# EAGLE design EasyEAP (EAGLE 8.6.0)
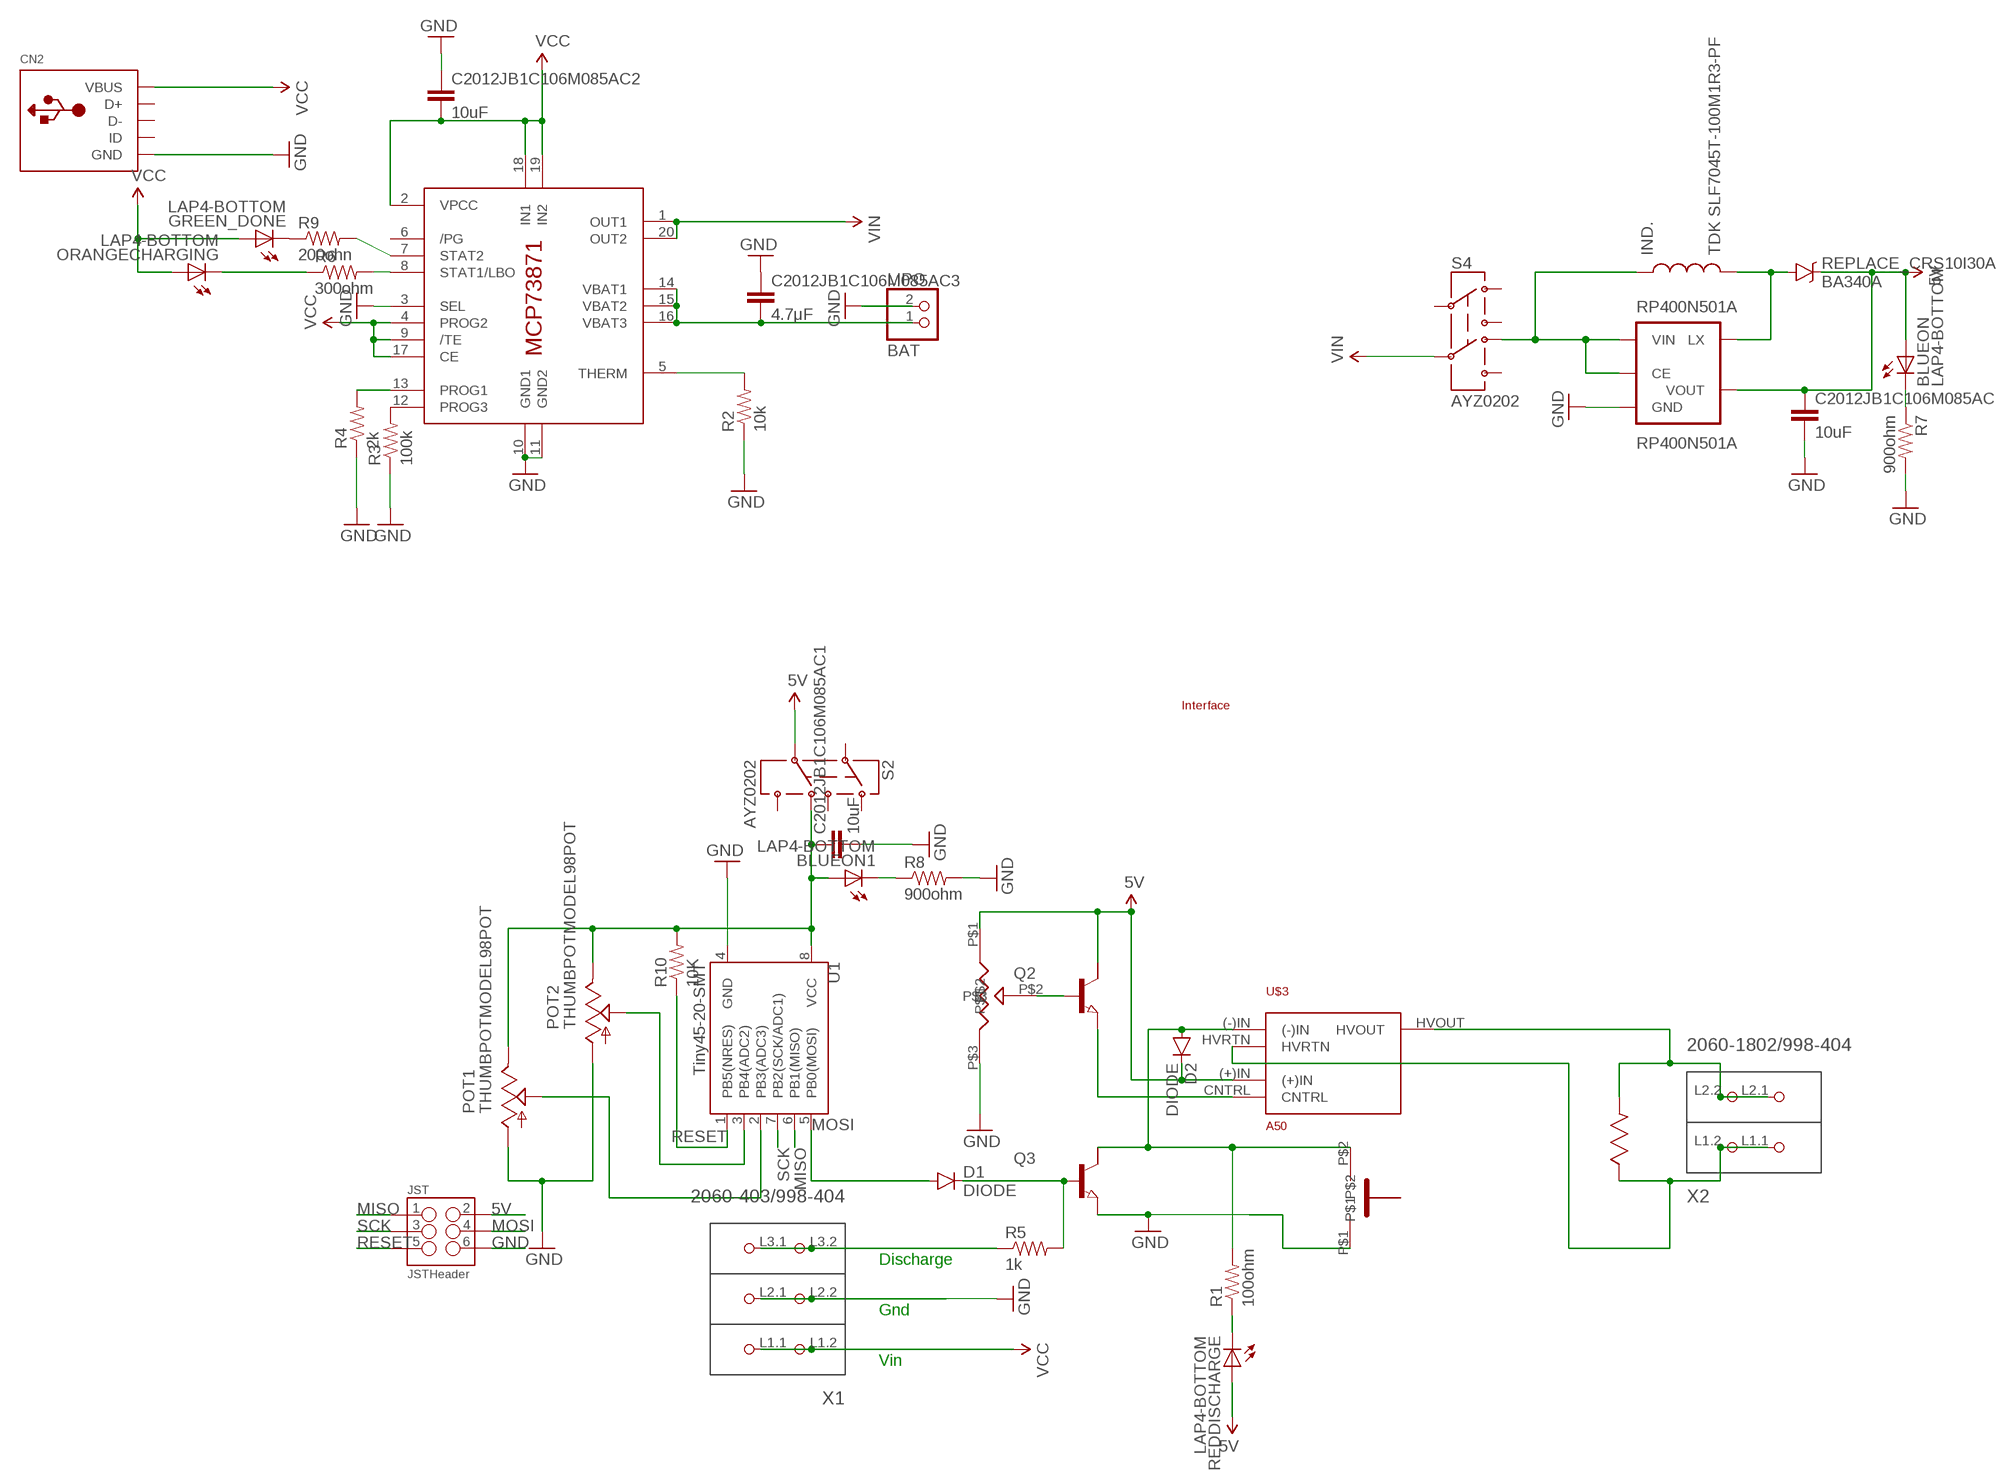
[diagram p0: schematic, sheet 1]

## Parts
BLUEON  LAP4-BOTTOM  [P47F-BOTTOM]
BLUEON1  LAP4-BOTTOM  [P47F-BOTTOM]
C2012JB1C106M085AC  10uF  22UF-16V-20%-(1210)  [1210]
C2012JB1C106M085AC1  10uF  22UF-16V-20%-(1210)  [1210]
C2012JB1C106M085AC2  10uF  22UF-16V-20%-(1210)  [1210]
C2012JB1C106M085AC3  4.7μF  22UF-16V-20%-(1210)  [1210]
CN2  USBMINIB  [USB-MINIB]
D1  DIODE  DIODESMA-ALT  [SMA-DIODE_ALT]
D2  DIODE  DIODESMA-ALT  [SMA-DIODE_ALT]
GREEN_DONE  LAP4-BOTTOM  [P47F-BOTTOM]
IC1  MCP73871  [QFN20]
IND.  TDK SLF7045T-100M1R3-PF  INDUCTOR-B82462G  [B82462G]
JST  JSTHeader  M03X2FEMALE_SMD  [2X3_SMD]
LIPO  BAT  JST_2PIN-SMT-RA  [JST-PH-2-SMT-RA]
ORANGECHARGING  LAP4-BOTTOM  [P47F-BOTTOM]
POT1  THUMBPOTMODEL98POT  [THUMBWHEEL]
POT2  THUMBPOTMODEL98POT  [THUMBWHEEL]
Q2  NPN-TRANSISTIOR-2COLSOT89  [SOT89]
Q3  NPN-TRANSISTIOR-2COLSOT89  [SOT89]
R1  100ohm  RESISTOR1206  [1206]
R2  10k  RESISTOR1206  [1206]
R3  100k  RESISTOR1206  [1206]
R4  2k  RESISTOR1206  [1206]
R5  1k  RESISTOR1206  [1206]
R6  300ohm  RESISTOR1206  [1206]
R7  900ohm  RESISTOR1206  [1206]
R8  900ohm  RESISTOR1206  [1206]
R9  200ohn  RESISTOR1206  [1206]
R10  10K  RESISTOR1206  [1206]
REDDISCHARGE  LAP4-BOTTOM  [P47F-BOTTOM]
REPLACE_CRS10I30A  BA340A  B340A  [SMA-DIODE]
RP400N501A  RP400N501A  [SOT23-5]
S2  AYZ0202  [AYZ0202]
S4  AYZ0202  [AYZ0202]
U1  Tiny45-20-SMT  ATTINY45TINY45-20-SMT  [SO08-EIAJ]
U$2  4020SMD  [4020SMD]
U$3  A50  [A50]
U$8  VISHAY  [VISHAY]
U$9  GRAYHILLPUSHBUTTON  [GRAYHILLSERIES30]
U$10  INTERFACE_EAP  [INTERFACE_EAP]
X1  2060-403/998-404  [P-2060-403/998-404]
X2  2060-1802/998-404  [P-2060-1802/998-404]

## Nets
5V: BLUEON.A C2012JB1C106M085AC.1 D2.C JST.2 Q2.2(C) REDDISCHARGE.A REPLACE_CRS10I30A.C RP400N501A.4(VOUT) S2.5 U$3.(+)IN U$8.P$1
5VSEQUENCE: BLUEON1.A C2012JB1C106M085AC1.1 POT1.3(E) POT2.3(E) R10.2 S2.6 U1.8(VCC)
15K: POT1.2(S) U1.2(PB3(ADC3))
DISCHARGE: R5.1 X1.L3.1(P3.1) X1.L3.2(P3.2)
GND: C2012JB1C106M085AC1.2 C2012JB1C106M085AC2.1 C2012JB1C106M085AC3.1 C2012JB1C106M085AC.2 CN2.GND IC1.3(SEL) IC1.10(GND1) IC1.11(GND2) JST.6 LIPO.2 POT1.1(A) POT2.1(A) Q3.3(E) R2.1 R3.1 R4.1 R7.2 R8.2 RP400N501A.2(GND) U1.4(GND) U$8.P$3 U$9.P$1 X1.L2.1(P2.1) X1.L2.2(P2.2)
HVIN: U$2.P$1 U$3.HVRTN X2.L1.1(P1.1) X2.L1.2(P1.2)
HVOUT: U$2.P$2 U$3.HVOUT X2.L2.1(P2.1) X2.L2.2(P2.2)
MISO: JST.1 U1.6(PB1(MISO))
MOSI: D1.A JST.4 U1.5(PB0(MOSI))
N$1: IND..P$2 REPLACE_CRS10I30A.A RP400N501A.5(LX)
N$2: D1.C Q3.1(B) R5.2
N$3: BLUEON.C R7.1
N$6: D2.A Q3.2(C) R1.2 U$3.(-)IN U$9.P$2
N$7: R1.1 REDDISCHARGE.C
N$8: BLUEON1.C R8.1
N$9: C2012JB1C106M085AC3.2 IC1.14(VBAT1) IC1.15(VBAT2) IC1.16(VBAT3) LIPO.1
N$10: Q2.3(E) U$3.CNTRL
N$11: IC1.5(THERM) R2.2
N$12: IC1.12(PROG3) R3.2
N$13: Q2.1(B) U$8.P$2
N$14: IC1.13(PROG1) R4.2
N$15: POT2.2(S) U1.3(PB4(ADC2))
N$18: IC1.8(STAT1/LBO) R6.2
N$20: ORANGECHARGING.C R6.1
N$21: IND..P$1 RP400N501A.1(CE) RP400N501A.3(VIN) S4.6
N$31: GREEN_DONE.C R9.1
N$32: IC1.7(STAT2) R9.2
RESET: JST.5 R10.1 U1.1(PB5(NRES))
SCK: JST.3 U1.7(PB2(SCK/ADC1))
VCC: C2012JB1C106M085AC2.2 CN2.VBUS GREEN_DONE.A IC1.2(VPCC) IC1.4(PROG2) IC1.9(/TE) IC1.17(CE) IC1.18(IN1) IC1.19(IN2) ORANGECHARGING.A X1.L1.1(P1.1) X1.L1.2(P1.2)
VIN: IC1.1(OUT1) IC1.20(OUT2) S4.5
Unconnected: CN2.D+ CN2.D- CN2.ID IC1.6(/PG) Q2.2@1(C/) Q3.2@1(C/) S2.1 S2.2 S2.3 S2.4 S4.1 S4.2 S4.3 S4.4

## Notes on the sheet
- Discharge
- Gnd
- Vin

## Library data of the parts
BLUEON BLUEON1 GREEN_DONE ORANGECHARGING REDDISCHARGE = led:*P4: PointLED® Enhanced Thinfilm LED TOP & BOTTOM mount LS P47F, LR P47F, LA P47F, LY P47F, LT P4SG, LB P4SG, LW P4SG Source: http://catalog.osram-os.com .. LA_LR_LS_LY_P47F_Pb_free.pdf
C2012JB1C106M085AC C2012JB1C106M085AC1-C2012JB1C106M085AC3 = SparkFun-Capacitors:22UF-16V-20%-(1210): CAP-10381; PROD_ID: CAP-10381; VALUE: 22uF
CN2 = adafruit:USB: USB Connectors USBMINIB - Surface Mount Female Mini-B USB Connector 4UConnector: 06564 By microbuilder.eu Thru-hole RA Female Mini-B USB Connector 4UConnector: 18732 By ladyada.net
D1 D2 = SparkFun-DiscreteSemi:DIODE: Diode These are standard reverse protection diodes and small signal diodes. SMA package can handle up to about 1A. SOD-323 can handle about 200mA. What the SOD-323 package when ordering, there are some mfgs out there that are 5-pin packages.
IC1 = adafruit:MCP73871
IND. = SparkFun:INDUCTOR: Inductors Basic Inductor/Choke - 0603 and 1206. Footprints are not proven and vary greatly between part numbers.
JST = SparkFun-Connectors:M03X2: 2x3 .1" header. Shrouded, with keying- CONN-10681 SMT- CONN-11415 Pogo pins- HW-11044; PROD_ID: CONN-11290
LIPO = adafruit:JST_2PIN: JST 2-Pin Connectors of various flavors SMT-RA (S2B-PH-SM4) 4UConnector #17311 SMT (B2B-PH-SM4) THM-RA (S2B-PH) THM (B2B-PH)
POT1 POT2 = Model93POT:THUMBPOT: Thumbwheel pot with switch Available in horizontal (Alpha RV121SF) or vertical (Xicon 311-1701)
Q2 Q3 = semicon-smd-ipc:NPN-TRANSISTIOR-2COL: NPN TRANSISTOR 2 colletor pins
R1-R10 = SparkFun-Resistors:RESISTOR: Resistor Basic schematic elements and footprints for 0603, 1206, and PTH resistors.
REPLACE_CRS10I30A = SparkFun-DiscreteSemi:B340A: Schottky Diode 3A-40V; PROD_ID: DIO-09886
RP400N501A = RP400N501A:RP400N501A
S2 S4 = SparkFun-Electromechanical:AYZ0202: SPDT Slide Switch Simple SMD single-pull double-throw slide switch. Good for less than 350mA power switch, switching UARTs between devices, etc. Spark Fun Electronics SKU : COM-00597; PROD_ID: SWCH-08179
U1 = SparkFun-DigitalIC:ATTINY45: Atmel 8-pin 2/4/8kB flash uC; PROD_ID: IC-08922
U$2 = smd4020:4020SMD
U$3 = EMCO:A50
U$8 = vishayPot:VISHAY
U$9 = grayhillPushButton:GRAYHILLPUSHBUTTON
U$10 = IAD_GRAFIX:INTERFACE_EAP
X1 = con-wago_2060:2060-403/998-404: Serie 2060, SMD-Leiterplattenklemme mit Betätigungsdrückern im Gurt 3-polig / Series 2060, SMD terminal block with push-buttons in tape-and-reel packing 3-pole Polzahl / Pole No.: 3 Rastermaß / Pitch: 4 mm Bemessungsspannung / Rated Voltage: 160 V Nennstrom / Nominal Current: 9 A Leiterquerschnitt / Conductor Size: 0.2 - 0.75 mm2 Anschlusstechnik / Connection Technology: CAGE CLAMP® S Leitereinführung (zur Platine) / Conductor entry angle (to PCB): 0 ° Farbe / Color: lichtgrau / light gray Stand: 01.01.2014. Die jeweils aktuellen Daten zu diesem Artikel finden Sie in unserem Produktkatalog, den Sie unter www.wago.com einsehen können. As of: 01/01/2014. Please find the newest data for this article in our product catalogue, which can be viewed under www.wago.com.
X2 = con-wago_2060:2060-1802/998-404: Serie 2060, THR-Leiterplattenklemme mit Betätigungsdrückern im Gurt 2-polig / Series 2060, THR terminal block with push-buttons in tape-and-reel packing 2-pole Polzahl / Pole No.: 2 Rastermaß / Pitch: 8 mm Bemessungsspannung / Rated Voltage: 630 V Nennstrom / Nominal Current: 9 A Leiterquerschnitt / Conductor Size: 0.2 - 0.75 mm2 Anschlusstechnik / Connection Technology: CAGE CLAMP® S Leitereinführung (zur Platine) / Conductor entry angle (to PCB): 0 ° Farbe / Color: lichtgrau / light gray Stand: 01.01.2014. Die jeweils aktuellen Daten zu diesem Artikel finden Sie in unserem Produktkatalog, den Sie unter www.wago.com einsehen können. As of: 01/01/2014. Please find the newest data for this article in our product catalogue, which can be viewed under www.wago.com.

## Board
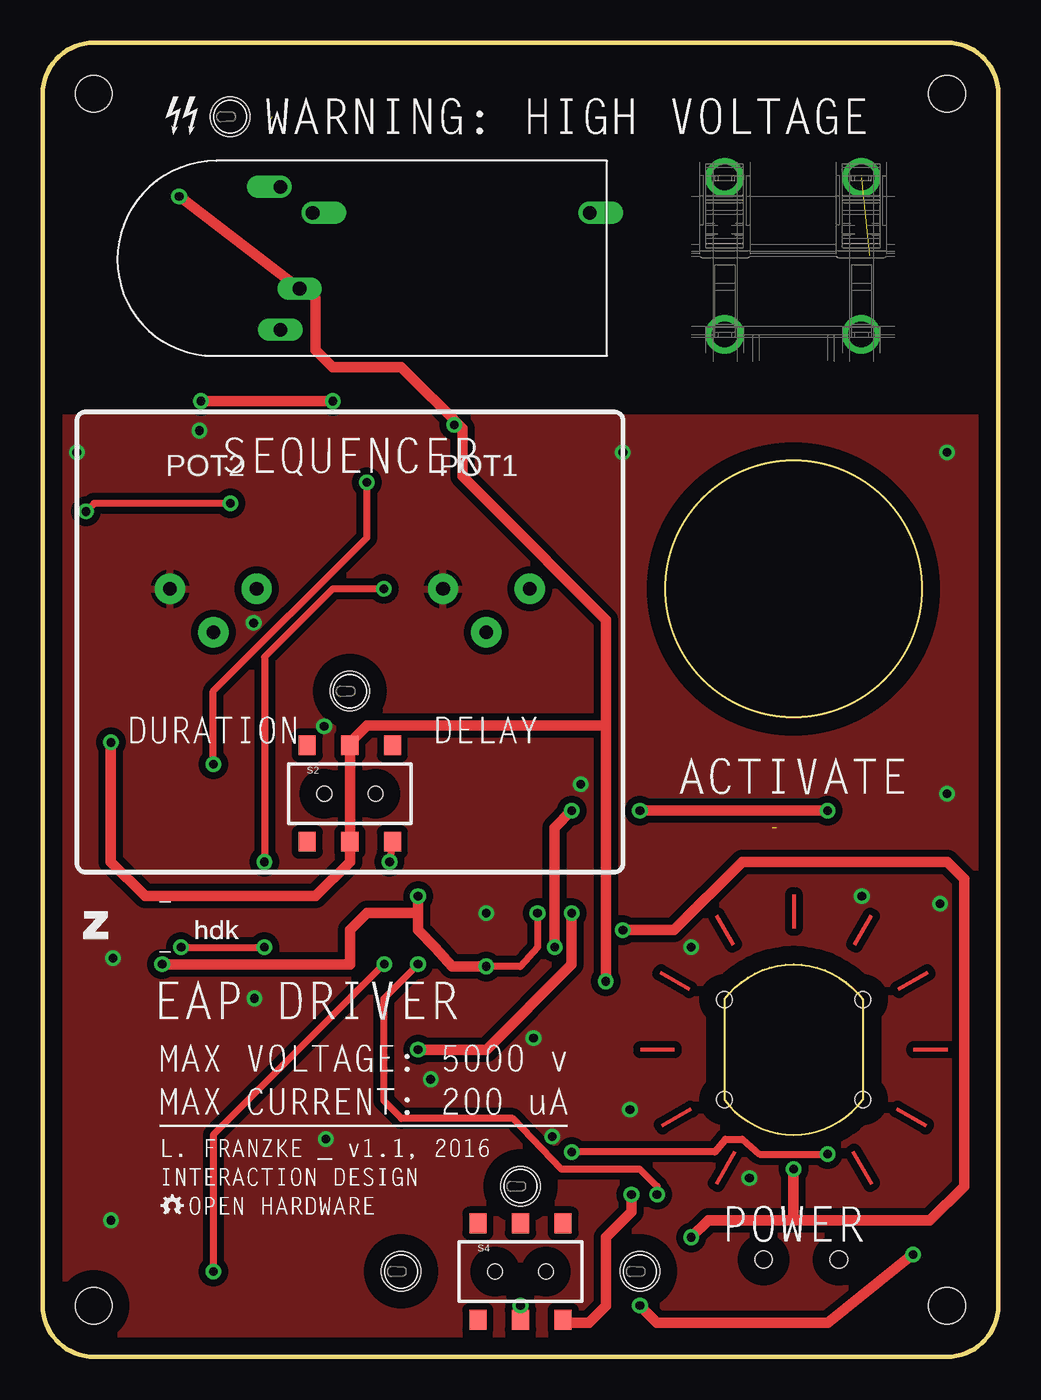
[diagram p1: board, top side]
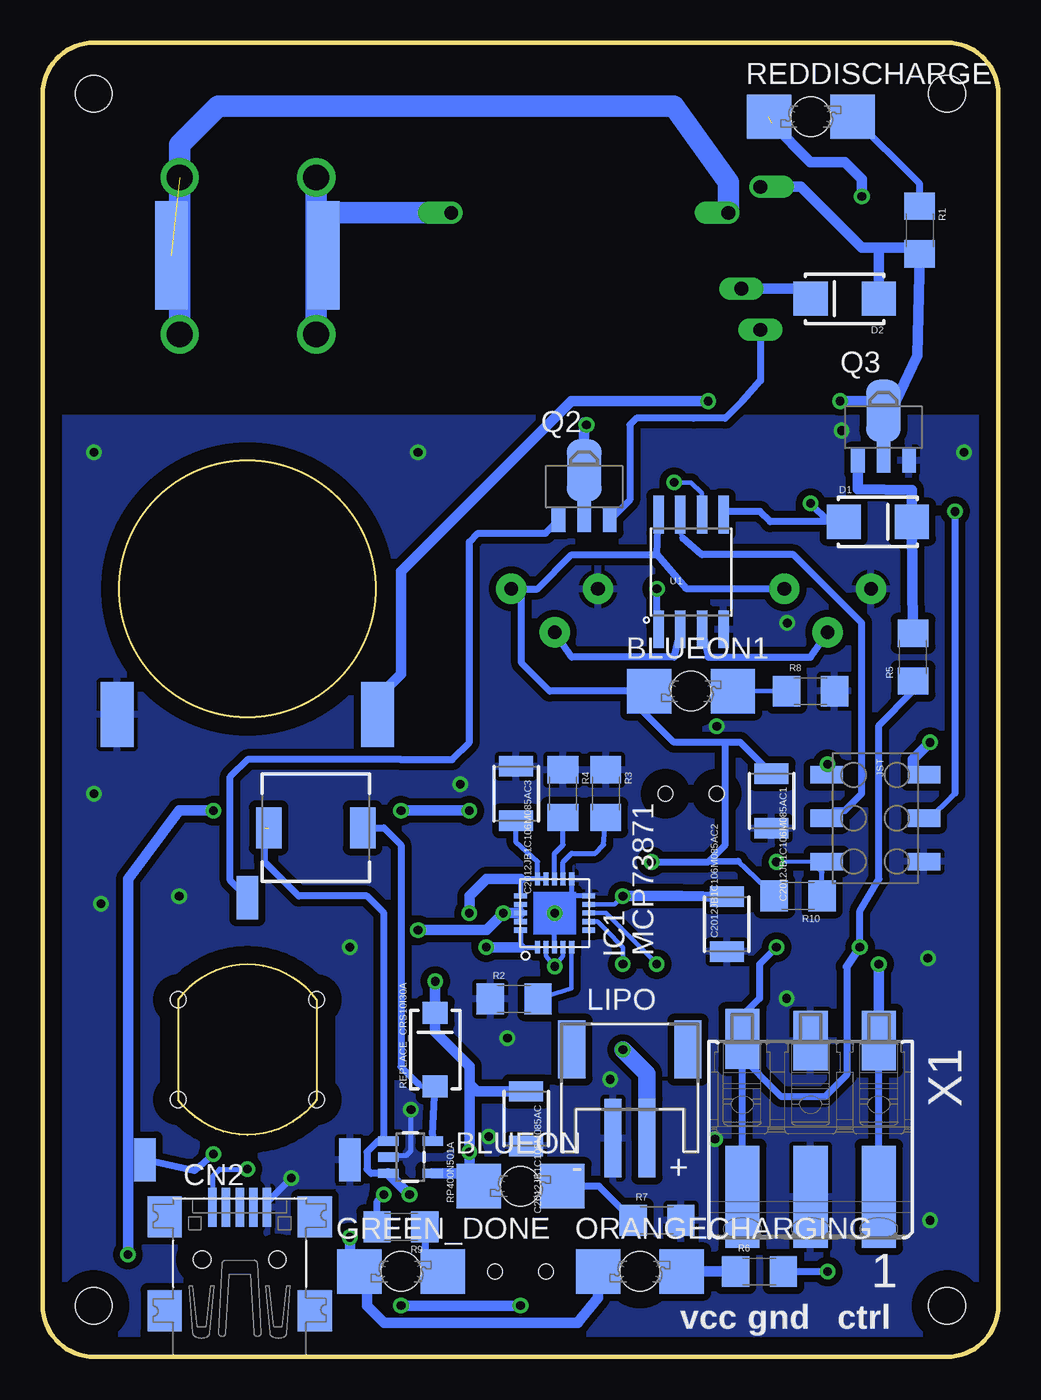
[diagram p2: board, bottom side, seen from below]

Size 56 x 77 mm. Coordinates in mm from the lower left corner, seen from the top.
Outline: 0,74 0,3 arc90 3,0 53,0 arc90 56,3 56,74 arc90 53,77 3,77 arc90 0,74
Copper layers (1*16): Top 0.035mm / dielectric 1.5mm / Bottom 0.035mm
Design rules "default *": minimum track width 15mil, minimum drill 12mil, track to track 8mil, track to pad 8mil, pad to pad 8mil, via to via 8mil, smd to smd 8mil, copper to edge 40mil, drill to drill 8mil, minimum pad ring 10mil, minimum via ring 8mil, stop-mask expansion 4mil, vias tented up to drill 0mil, thermal gap 10mil
Holes 2.13 mm at 3,3 3,74 53,74 3,3 53,3

### Footprints (pad centres in the part's own frame; a part is rotated, then mirrored left to right if it is on the bottom)
P47F-BOTTOM = smd 2.6 x 2.6: A -2.45,0; C 2.45,0 | hole 2.3: 0,0
1210 = smd 1.2 x 2: 1 -1.6,0; 2 1.6,0
USB-MINIB = smd 0.5 x 2.308: D+ 0,4.064; D- -0.8,4.064; GND 1.6,4.064; ID 0.8,4.064; VBUS -1.6,4.064 | smd 2 x 2.4: GND1 -4.4,-2; GND2 -4.4,3.5; GND3 4.4,3.5; GND4 4.4,-2 | hole 1: -2.2,1; 2.2,1
SMA-DIODE_ALT = smd 2 x 2: A -2,0; C 2,0
QFN20 = smd 0.75 x 0.3: 1 -2,1; 2 -2,0.5; 3 -2,0; 4 -2,-0.5; 5 -2,-1; 11 2,-1; 12 2,-0.5; 13 2,0; 14 2,0.5; 15 2,1 | smd 0.3 x 0.75: 6 -1,-2; 7 -0.5,-2; 8 0,-2; 9 0.5,-2; 10 1,-2; 16 1,2; 17 0.5,2; 18 0,2; 19 -0.5,2; 20 -1,2
B82462G = smd 2.4 x 1.5: P$1 0,2.75; P$2 0,-2.75
2X3_SMD = smd 1.02 x 1.9: 1 -2.54,-2.85; 2 -2.54,2.85; 3 0,-2.85; 4 0,2.85; 5 2.54,-2.85; 6 2.54,2.85
JST-PH-2-SMT-RA = smd 1 x 4.6: 1 1,-3.7; 2 -1,-3.7 | smd 1.6 x 3.4: NC1 -3.4,1.5; NC2 3.4,1.5
THUMBWHEEL = drill 0.8 pad 1.778: 1 -2.54,0; 2 0,-2.54; 3 2.54,0
SOT89 = smd 0.8 x 1.4: 1 -1.499,-1.981; 3 1.499,-1.981 | smd 0.8 x 1.9: 2 0,-1.727 | smd 2.032 x 3.65: 2@1 0,0.94
1206 = smd 1.6 x 1.8: 1 -1.4,0; 2 1.4,0
SMA-DIODE = smd 1.27 x 1.47: A -2.15,0; C 2.15,0
SOT23-5 = smd 0.55 x 1.2: 1 -0.95,-1.3; 2 0,-1.3; 3 0.95,-1.3; 4 0.95,1.3; 5 -0.95,1.3
AYZ0202 = smd 1 x 1.15: 1 -2.5,2.825; 2 0,2.825; 3 2.5,2.825; 4 -2.5,-2.825; 5 0,-2.825; 6 2.5,-2.825 | hole 0.85: 1.5,0; -1.5,0
SO08-EIAJ = smd 0.61 x 2.21: 1 -1.905,-3.378; 2 -0.635,-3.378; 3 0.635,-3.378; 4 1.905,-3.378; 5 1.905,3.353; 6 0.635,3.353; 7 -0.635,3.353; 8 -1.905,3.353
4020SMD = smd 1.905 x 6.35: P$1 -4.445,0; P$2 4.445,0
A50 = drill 0.8 long: (+)IN -6.325,-1.143; CNTRL -7.442,-3.556 | drill 0.8 offset: (-)IN -7.442,4.826; HVOUT 10.668,3.302; HVRTN -5.563,3.302
VISHAY = smd 1.27 x 2.54 bottom: P$1 6,-6.46; P$2 0,8.905; P$3 -6,-6.46 | hole 0.9: -4.05,2.93; 4.05,2.93; -4.05,-2.93; 4.05,-2.93
GRAYHILLSERIES30 = smd 1.93 x 3.81 bottom: P$1 7.62,-7.366; P$2 -7.62,-7.366
P-2060-403/998-404 = smd 6 x 2: L1.1 4.625,4; L2.1 4.625,0; L3.1 4.625,-4 | smd 3.5 x 2: L1.2 -4.525,4; L2.2 -4.525,0; L3.2 -4.625,-4
P-2060-1802/998-404 = drill 1.5: L1.1 4.6,4; L1.2 -4.6,4; L2.1 4.6,-4; L2.2 -4.6,-4

### Placement (x,y rotation side)
BLUEON  28,10 0 bottom
BLUEON1  18,39 0 bottom
C2012JB1C106M085AC  27.67,13.96 270 bottom
C2012JB1C106M085AC1  13.29,32.57 270 bottom
C2012JB1C106M085AC2  15.91,25.35 90 bottom
C2012JB1C106M085AC3  28.25,33 270 bottom
CN2  44.45,4.7 0 bottom
D1  7.06,48.93 0 bottom
D2  9,62 180 bottom
GREEN_DONE  35,5 0 bottom
IC1  26,26 90 bottom
IND.  40,31 90 bottom
JST  7.21,31.56 270 bottom
LIPO  21.59,16.51 0 bottom
ORANGECHARGING  21,5 0 bottom
POT1  26,45 0 top
POT2  10,45 0 top
Q2  24.27,51 0 bottom
Q3  6.73,54.48 0 bottom
R1  4.61,66.02 270 bottom
R2  28.37,20.97 0 bottom
R3  23,33 270 bottom
R4  25.51,33 270 bottom
R5  5,41 90 bottom
R6  14,5 0 bottom
R7  20,8 0 bottom
R8  11,39 0 bottom
R9  35,7.62 180 bottom
R10  11.73,27 180 bottom
REDDISCHARGE  10.99,72.66 0 bottom
REPLACE_CRS10I30A  33,18 90 bottom
RP400N501A  34.45,11.7 270 bottom
S2  18,33 0 top
S4  28,5 0 top
U1  18,46 0 bottom
U$2  44.01,64.52 0 bottom
U$3  21.38,63.73 0 top
U$6  [WARNING]  6.6,72.64 0 top
U$8  44,18 0 top
U$9  44,45 0 top
U$10  1.65,55.88 0 top
X1  11,14 270 bottom
X2  43.97,64.5 270 top

### Tracks (layer width: path | path; a pad name or v marks a point on that pad's centre or on a via)
5V  (via drill 0.51)  (1 unrouted)
  Top 0.254: v33,22 33.02,22.02
  Top 0.406: v31,12 39.38,12 40,12.75 41,12.75 42,11.87 v46,11.87 | 24.6,54.4 24.34,54.4 v24.13,54.61
  Top 0.61: 33.02,37 33.02,43.18 26.1,50.1 24.6,51.6 24.6,53 24.6,54.4 23.62,55.38 22,57 21,58 17,58 16,59 16,62 15.41,62.59 U$3.(+)IN v8,67.99 | 33.02,37 33.02,22.86 33.02,22.02 | 33.02,37 20,37 19,37 18,36 S2.5 18,29 16,27 14,27 6,27 4,29 v4,36 | v24.13,54.61 24.13,54.87
  Bottom 0.254: 31,11.25 31,10.95 31.2,10.75 30.85,11.1 31,11.25 | 31,11.25 v31,12 | 24.27,54.73 24.26,54.74 v24.13,54.61
  Bottom 0.406: 31.2,10.75 BLUEON.A | v46,11.87 47.09,10.9 U$8.P$1
  Bottom 0.61: RP400N501A.4 31.2,10.75 | v4,36 5,35 5,34 4.9,34.1 JST.2 | v33,22 REPLACE_CRS10I30A.C 33.05,19.64 33.02,19.61 33.02,19.05 31,17.03 31,16 | 31,11.25 31,16 | 13.27,72.27 11,70 9,70 8,69 v8,67.99 | Q2.2 24.27,54.73 | U$3.(+)IN 11.59,62.59 D2.C | C2012JB1C106M085AC.1 30.55,15.55 31,16
5VSEQUENCE  (via drill 0.51)
  Top 0.406: S2.6 v20.32,29
  Bottom 0.254: 21,38 20.45,38.55 BLUEON1.A
  Bottom 0.305: R10.2 15.25,29.03
  Bottom 0.406: POT2.3 18.27,45 20,47 | 20,47 U1.8 | C2012JB1C106M085AC1.1 15.12,36 16,36 | 16,36 19,36 21,38 | v20.32,29 17,29 | 17,29 16,30 16,36 | POT1.3 27.94,45 | 27.94,45 27,45 25,47 20,47 | 15.25,29.03 17,29 | BLUEON1.A 26.3,39 27.94,40.64 27.94,45
15K
  Bottom 0.406: U1.2 19,41 25,41 POT1.2
DISCHARGE  (via drill 0.51)
  Top 0.406: v8.11,24 v13,24
  Bottom 0.254: 15,20 15,19 | 5,39 R5.1
  Bottom 0.406: X1.L3.1 X1.L3.2 | v13,24 14,23 14,21 15,20 | v8.11,24 8.11,26.13 7,28 7,37 5,39 | 15.24,17.78 12.7,15.24 10.16,15.24 8.89,16.51 8.89,22.86
  Bottom 0.483: 8.89,22.86 v8.11,24
  Bottom 1.016: 15.24,17.78 X1.L3.2
GND  (via drill 0.51)
  Bottom 0.305: IC1.3 v26,26 26,27 25,27 | IC1.10 25,27 | IC1.11 25,27 | RP400N501A.2 35.64,11.81 34.67,11.81 34.42,12.06 v34.42,14.48
  Bottom 0.406: CN2.GND 42.85,9.04 v41.42,10.48
  other vias: 12.37,43 16.6,12.76 34,53 4.13,23.36 12.4,21 22.73,16.26 31.53,33.56 48,27 38,24 29.86,12.91 53,33 53,53 4,8 9.19,54.27 16.49,36.96 2,53 52.58,26.54 28.77,18.67
  pour Bottom (isolate 0.406): 0,3 arc90 3,0 53,0 arc90 56,3 56,55 0,55
  pour Top (isolate 0.406): 0,3 arc90 3,0 53,0 arc90 56,3 56,55 0,55
HVIN  (1 unrouted)
  Bottom 1.27: X2.L1.1 X2.L1.2 47.97,71.03 47.5,71.5 | 47.5,71.5 45.73,73.27 | U$3.HVRTN 15.82,68.82 19,73.27 45.73,73.27 | 45.73,73.27 47.5,71.5
HVOUT
  Bottom 0.254: U$2.P$2 39.57,65.63 39.97,66.04
  Bottom 1.27: X2.L2.1 39.97,66.04 39.97,67 | 39.97,67 X2.L2.2 | U$3.HVOUT 39.94,67.03 39.97,67
MISO  (via drill 0.51)
  Top 0.406: v10,34.73 10,39 19,48 v19,51.24
  Bottom 0.254: JST.1 10,34.16 | v19,51.24 18,51.24 17.36,50.6 U1.6
  Bottom 0.406: 10,34.16 v10,34.73
MOSI  (via drill 0.51)
  Top 0.406: v11,50 6.35,50 3.01,50 v2.54,49.53
  Bottom 0.254: 15.92,49.53 U1.5
  Bottom 0.305: JST.4 4,31.56 2.78,32.78 | 2.78,32.78 2.54,33.02 2.78,32.78 | D1.A 9.93,48.93
  Bottom 0.406: D1.A 13.37,48.93 13.97,49.53 15.92,49.53 | 9.93,48.93 v11,50 | v2.54,49.53 2.54,33.02
N$1
  Bottom 0.254: RP400N501A.5 33.15,13 | 34,16 33.85,15.85 REPLACE_CRS10I30A.A
  Bottom 0.406: 33.15,13 REPLACE_CRS10I30A.A | IND..P$2 36,31 35,30 35,17 34,16
N$2
  Bottom 0.61: R5.2 D1.C 5.06,49.51 5.08,50.8 8.23,50.83 Q3.1
N$3
  Bottom 0.406: R7.1 23.4,10 BLUEON.C
N$6  (via drill 0.51)
  Top 0.61: v17,56 v9.27,56
  Bottom 0.406: Q3.2 6.73,55.46
  Bottom 0.61: U$3.(-)IN 11.56,68.56 8,65 7,65 | 7,65 4.99,65 R1.2 4.74,58.66 6,56 6.35,56 | U$9.P$2 36.65,38.35 35,40 35,46 25,56 v17,56 | 6.35,56 v9.27,56 | D2.A 7,65 | 6.73,55.46 6.73,55.62 6.35,56
N$7
  Bottom 0.406: R1.1 4.61,68.73 REDDISCHARGE.C
N$8
  Bottom 0.254: BLUEON1.C R8.1
N$9  (via drill 0.51)
  Top 0.61: v22,18 26,18 31,23 v31,26
  Bottom 0.305: IC1.15 27,29 28.25,30.13 C2012JB1C106M085AC3.2 | IC1.14 IC1.15 | IC1.15 28,28 IC1.16
  Bottom 0.61: v31,26 31,27 30,28 28,28
  Bottom 1.016: LIPO.1 20.59,16.59 v22,18
N$10
  Bottom 0.406: U$3.CNTRL 13.94,57.19 15,56 16,55 17.85,55 21.2,55 21.59,54.61 21.59,50.2 Q2.3
N$11
  Bottom 0.254: IC1.5 25,21.6 R2.2
N$12
  Bottom 0.305: IC1.12 25.5,28.99 25,29.51 23.62,29.51 23.13,30 R3.2
N$13
  Bottom 0.406: U$8.P$2 45,27.91 45,34 44,35 35,35 32,35 31,36 31,47 31,47.74 30.48,48.26 26.53,48.26 Q2.1
N$14
  Bottom 0.305: IC1.13 26,29.51 25.51,30 25.51,31 R4.2
N$15
  Bottom 0.406: POT2.2 11,41 17,41 U1.3
N$18  (via drill 0.51)
  Top 0.406: v20.02,23.02 10,13 v10,5
  Bottom 0.254: v20.02,23.02 23,26 IC1.8
  Bottom 0.406: R6.2 v10,5
N$20
  Bottom 0.61: ORANGECHARGING.C R6.1
N$21  (via drill 0.51)  (1 unrouted)
  Top 0.254: 30.68,2 S4.6
  Top 0.61: v34.5,9.5 34.5,8.5 33,7 33,3 32,2 30.68,2
  Bottom 0.254: RP400N501A.1 36.35,12.65 36,13 | RP400N501A.3
  Bottom 0.406: 36.35,12.65 37,12 37,11 36.75,10.75 RP400N501A.3 | 36,13 36,15 36,26 37,27 41,27 43,29 43,31
  Bottom 0.61: RP400N501A.3 v34.5,9.5
N$31
  Bottom 0.406: R9.1 33.6,6.05 GREEN_DONE.C
N$32  (via drill 0.51)
  Top 0.406: v36,9.5 36,10 35,11 30.4,11 27.56,13.97 21.03,13.97 21,14 20,15 20,21 v22,23
  Bottom 0.254: v22,23 22,24 23,25 23.5,25.5 IC1.7
  Bottom 0.406: R9.2 36.4,9.1 v36,9.5
RESET  (via drill 0.51)
  Top 0.406: v20,45 17,45 13,41 v13,29
  Bottom 0.254: U1.1 20,42.72 | v13,29 10.98,29.02 JST.5
  Bottom 0.305: R10.1 10.33,28.4 10.98,29.02
  Bottom 0.406: 20,42.72 v20,45
SCK
  Bottom 0.254: JST.3 9.62,32 | 18.5,48 18.64,48.37 U1.7
  Bottom 0.406: 9.62,32 9,32 8,33 8,43 11,46 12,47 17.36,47 18.5,48
VCC  (via drill 0.51)
  Top 0.406: v29,26 29,24 28,22.87 v26,22.87
  Top 0.61: v26,22.87 24,22.87 23,24 22,25 22,26 | v22,27 22,26 | 22,26 21,26 20.6,26 19,26 18,25 18,23 v7,23 | v34,25 37,25 41,29 53,29 54,28 54,10 52,8 44,8 | 44,8 v44,11 | v38,7 39,8 44,8
  Bottom 0.254: IC1.4 25.5,23.5 v26,22.87 26.5,23.5 IC1.2 | IC1.9 22.5,26.5 v22,27 | CN2.VBUS 46,8.81 | GREEN_DONE.A 38,5.55
  Bottom 0.305: IC1.19 IC1.18 IC1.17 | 46,8.81 46,10.63 45.63,11 v44,11
  Bottom 0.406: X1.L1.1 X1.L1.2
  Bottom 0.61: X1.L1.2 v7,23 | IC1.18 v29,26 30,25 v34,25 | 38,5.55 v38,7 | GREEN_DONE.A 37,4.55 37,3 36,2 24.64,2 24.65,1.98 23.45,3.45 ORANGECHARGING.A | C2012JB1C106M085AC2.2 18.59,27.02 v22,27
VIN  (via drill 0.51)
  Top 0.61: v30,24 30,31 v31,32 | v35,32 v46,32 | v51,6 46,2 36,2 v35,3 | S4.5 v28,3
  Bottom 0.305: IC1.20 28,24 IC1.1
  Bottom 0.61: 28,24 v30,24 | v31,32 v35,32 | v46,32 48,32 51,28 v51,6 | v28,3 30,3 31,3 v35,3

### Text on the board
bPlace: ctrl | gnd | vcc
bStop: Luke Franzke 2016